# EAGLE design 23b_clock_noleds (EAGLE 5.11)

## Sheet 1 of 2
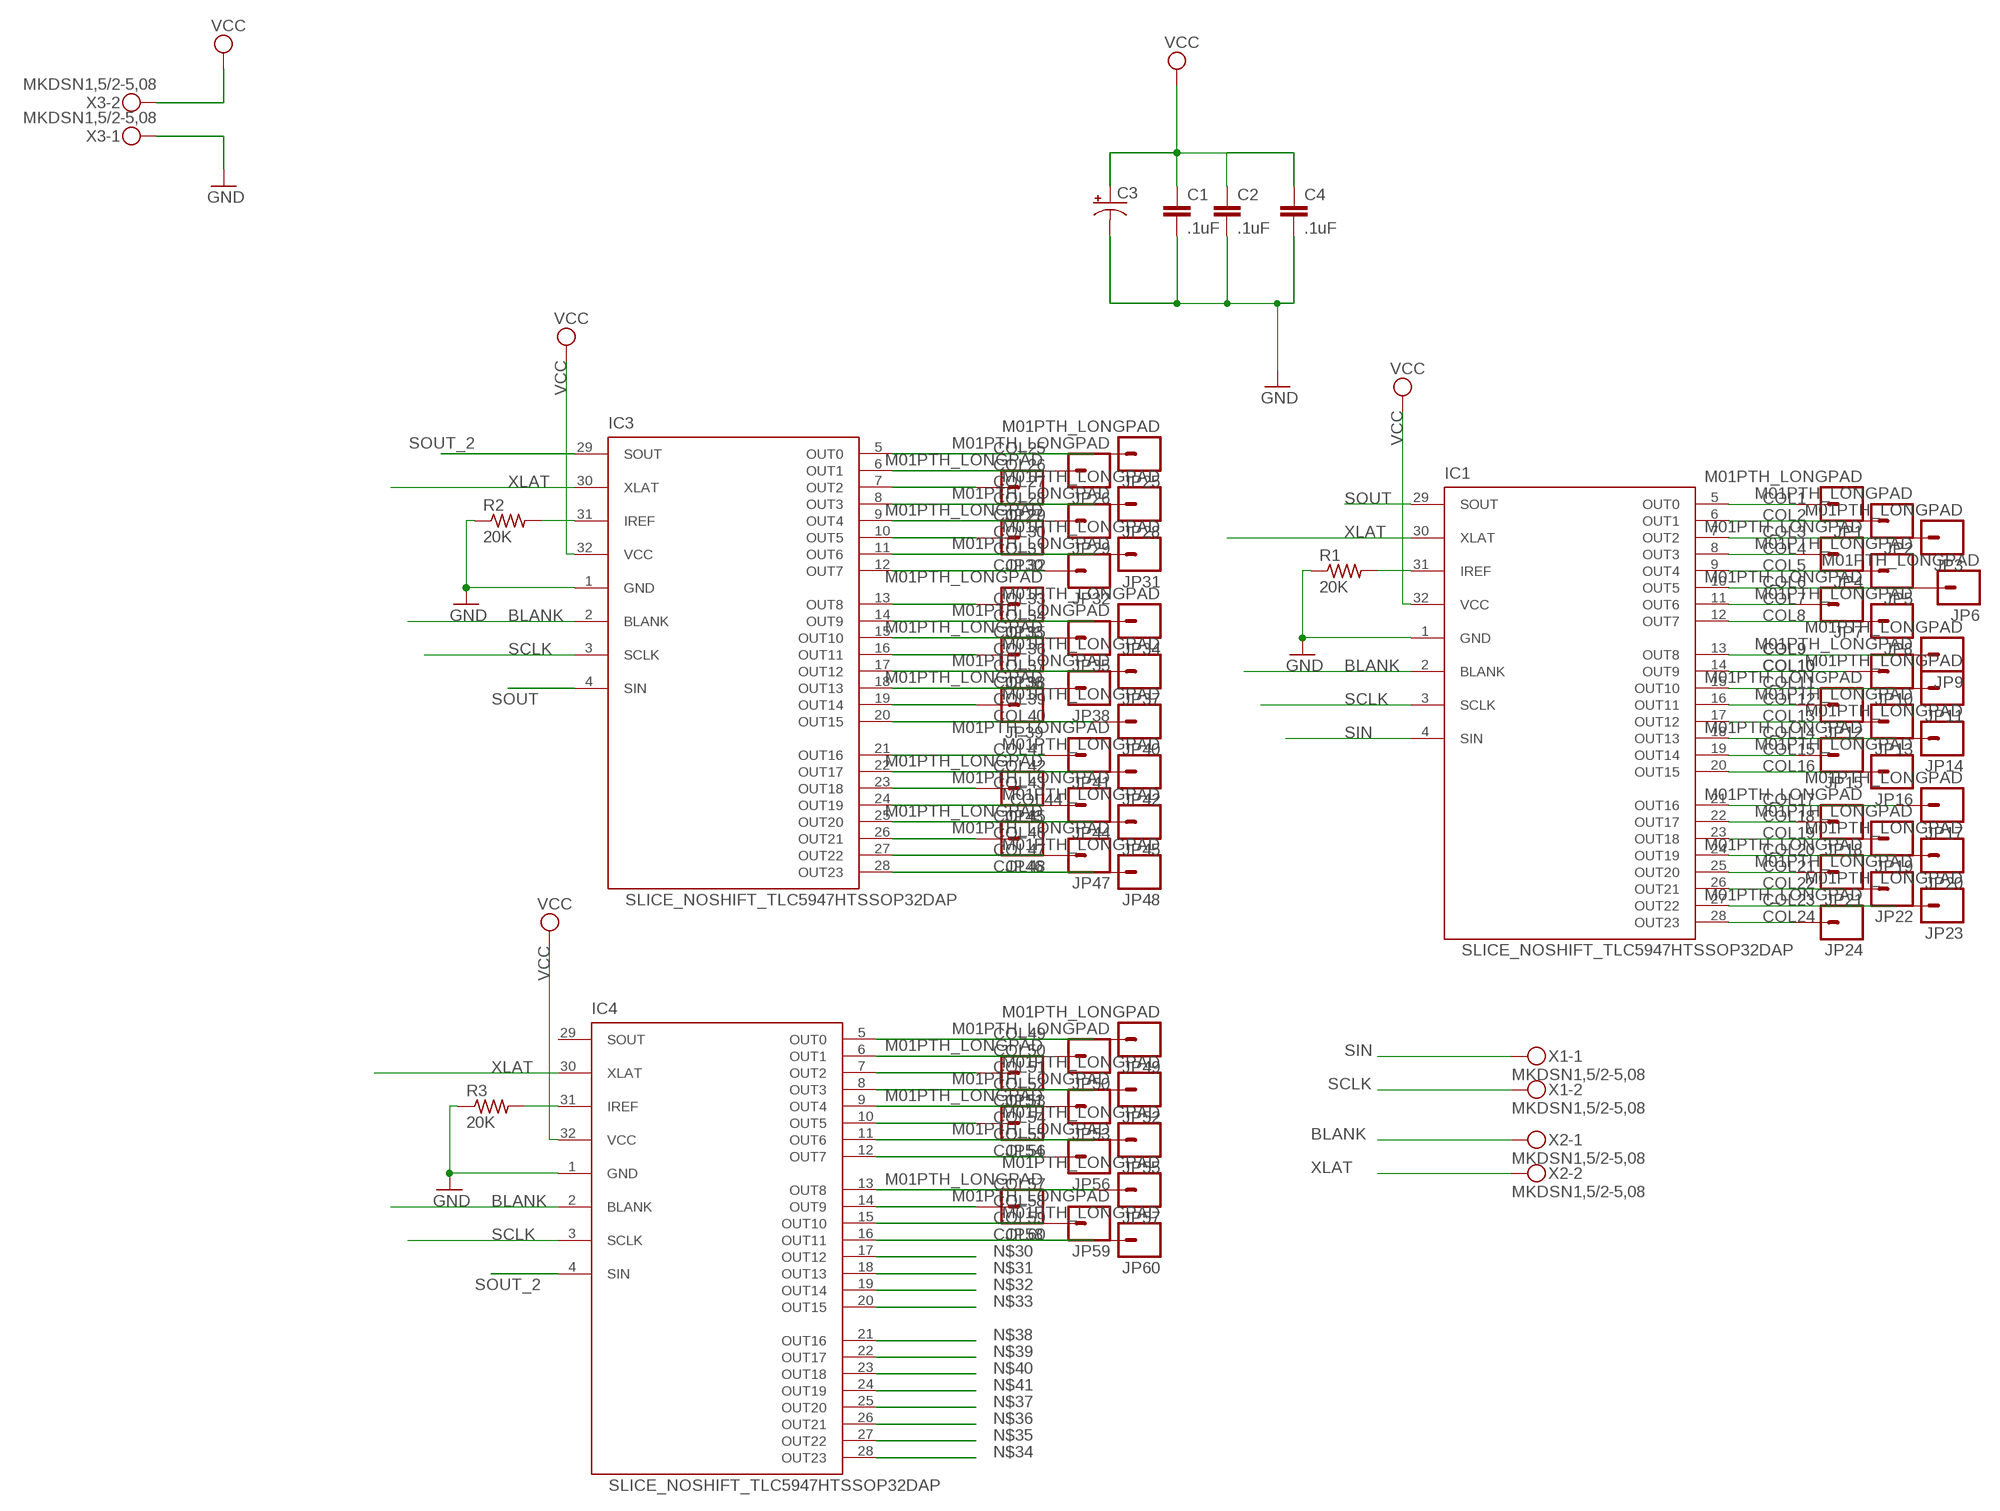
[diagram p0: schematic, sheet 1]

### Parts
C1  .1uF  CAP0805  [0805]
C2  .1uF  CAP0805  [0805]
C3  CAP_POL7343  [EIA7343]
C4  .1uF  CAP0805  [0805]
IC1  SLICE_NOSHIFT_TLC5947HTSSOP32DAP  [HTSSOP32DAP]
IC3  SLICE_NOSHIFT_TLC5947HTSSOP32DAP  [HTSSOP32DAP]
IC4  SLICE_NOSHIFT_TLC5947HTSSOP32DAP  [HTSSOP32DAP]
JP1  M01PTH_LONGPAD  [1X01_LONGPAD]
JP2  M01PTH_LONGPAD  [1X01_LONGPAD]
JP3  M01PTH_LONGPAD  [1X01_LONGPAD]
JP4  M01PTH_LONGPAD  [1X01_LONGPAD]
JP5  M01PTH_LONGPAD  [1X01_LONGPAD]
JP6  M01PTH_LONGPAD  [1X01_LONGPAD]
JP7  M01PTH_LONGPAD  [1X01_LONGPAD]
JP8  M01PTH_LONGPAD  [1X01_LONGPAD]
JP9  M01PTH_LONGPAD  [1X01_LONGPAD]
JP10  M01PTH_LONGPAD  [1X01_LONGPAD]
JP11  M01PTH_LONGPAD  [1X01_LONGPAD]
JP12  M01PTH_LONGPAD  [1X01_LONGPAD]
JP13  M01PTH_LONGPAD  [1X01_LONGPAD]
JP14  M01PTH_LONGPAD  [1X01_LONGPAD]
JP15  M01PTH_LONGPAD  [1X01_LONGPAD]
JP16  M01PTH_LONGPAD  [1X01_LONGPAD]
JP17  M01PTH_LONGPAD  [1X01_LONGPAD]
JP18  M01PTH_LONGPAD  [1X01_LONGPAD]
JP19  M01PTH_LONGPAD  [1X01_LONGPAD]
JP20  M01PTH_LONGPAD  [1X01_LONGPAD]
JP21  M01PTH_LONGPAD  [1X01_LONGPAD]
JP22  M01PTH_LONGPAD  [1X01_LONGPAD]
JP23  M01PTH_LONGPAD  [1X01_LONGPAD]
JP24  M01PTH_LONGPAD  [1X01_LONGPAD]
JP25  M01PTH_LONGPAD  [1X01_LONGPAD]
JP26  M01PTH_LONGPAD  [1X01_LONGPAD]
JP27  M01PTH_LONGPAD  [1X01_LONGPAD]
JP28  M01PTH_LONGPAD  [1X01_LONGPAD]
JP29  M01PTH_LONGPAD  [1X01_LONGPAD]
JP30  M01PTH_LONGPAD  [1X01_LONGPAD]
JP31  M01PTH_LONGPAD  [1X01_LONGPAD]
JP32  M01PTH_LONGPAD  [1X01_LONGPAD]
JP33  M01PTH_LONGPAD  [1X01_LONGPAD]
JP34  M01PTH_LONGPAD  [1X01_LONGPAD]
JP35  M01PTH_LONGPAD  [1X01_LONGPAD]
JP36  M01PTH_LONGPAD  [1X01_LONGPAD]
JP37  M01PTH_LONGPAD  [1X01_LONGPAD]
JP38  M01PTH_LONGPAD  [1X01_LONGPAD]
JP39  M01PTH_LONGPAD  [1X01_LONGPAD]
JP40  M01PTH_LONGPAD  [1X01_LONGPAD]
JP41  M01PTH_LONGPAD  [1X01_LONGPAD]
JP42  M01PTH_LONGPAD  [1X01_LONGPAD]
JP43  M01PTH_LONGPAD  [1X01_LONGPAD]
JP44  M01PTH_LONGPAD  [1X01_LONGPAD]
JP45  M01PTH_LONGPAD  [1X01_LONGPAD]
JP46  M01PTH_LONGPAD  [1X01_LONGPAD]
JP47  M01PTH_LONGPAD  [1X01_LONGPAD]
JP48  M01PTH_LONGPAD  [1X01_LONGPAD]
JP49  M01PTH_LONGPAD  [1X01_LONGPAD]
JP50  M01PTH_LONGPAD  [1X01_LONGPAD]
JP51  M01PTH_LONGPAD  [1X01_LONGPAD]
JP52  M01PTH_LONGPAD  [1X01_LONGPAD]
JP53  M01PTH_LONGPAD  [1X01_LONGPAD]
JP54  M01PTH_LONGPAD  [1X01_LONGPAD]
JP55  M01PTH_LONGPAD  [1X01_LONGPAD]
JP56  M01PTH_LONGPAD  [1X01_LONGPAD]
JP57  M01PTH_LONGPAD  [1X01_LONGPAD]
JP58  M01PTH_LONGPAD  [1X01_LONGPAD]
JP59  M01PTH_LONGPAD  [1X01_LONGPAD]
JP60  M01PTH_LONGPAD  [1X01_LONGPAD]
R1  20K  R-US_R0805  [R0805]
R2  20K  R-US_R0805  [R0805]
R3  20K  R-US_R0805  [R0805]
X1  MKDSN1,5/2-5,08  [MKDSN1,5/2-5,08]
X2  MKDSN1,5/2-5,08  [MKDSN1,5/2-5,08]
X3  MKDSN1,5/2-5,08  [MKDSN1,5/2-5,08]

### Nets
BLANK: IC1.2(BLANK) IC3.2(BLANK) IC4.2(BLANK) X2.1
COL1: IC1.5(OUT0) JP1.1
COL2: IC1.6(OUT1) JP2.1
COL3: IC1.7(OUT2) JP3.1
COL4: IC1.8(OUT3) JP4.1
COL5: IC1.9(OUT4) JP5.1
COL6: IC1.10(OUT5) JP6.1
COL7: IC1.11(OUT6) JP7.1
COL8: IC1.12(OUT7) JP8.1
COL9: IC1.13(OUT8) JP9.1
COL10: IC1.14(OUT9) JP10.1
COL11: IC1.15(OUT10) JP11.1
COL12: IC1.16(OUT11) JP12.1
COL13: IC1.17(OUT12) JP13.1
COL14: IC1.18(OUT13) JP14.1
COL15: IC1.19(OUT14) JP15.1
COL16: IC1.20(OUT15) JP16.1
COL17: IC1.21(OUT16) JP17.1
COL18: IC1.22(OUT17) JP18.1
COL19: IC1.23(OUT18) JP19.1
COL20: IC1.24(OUT19) JP20.1
COL21: IC1.25(OUT20) JP21.1
COL22: IC1.26(OUT21) JP22.1
COL23: IC1.27(OUT22) JP23.1
COL24: IC1.28(OUT23) JP24.1
COL25: IC3.5(OUT0) JP25.1
COL26: IC3.6(OUT1) JP26.1
COL27: IC3.7(OUT2) JP27.1
COL28: IC3.8(OUT3) JP28.1
COL29: IC3.9(OUT4) JP29.1
COL30: IC3.10(OUT5) JP30.1
COL31: IC3.11(OUT6) JP31.1
COL32: IC3.12(OUT7) JP32.1
COL33: IC3.13(OUT8) JP33.1
COL34: IC3.14(OUT9) JP34.1
COL35: IC3.15(OUT10) JP35.1
COL36: IC3.16(OUT11) JP36.1
COL37: IC3.17(OUT12) JP37.1
COL38: IC3.18(OUT13) JP38.1
COL39: IC3.19(OUT14) JP39.1
COL40: IC3.20(OUT15) JP40.1
COL41: IC3.21(OUT16) JP41.1
COL42: IC3.22(OUT17) JP42.1
COL43: IC3.23(OUT18) JP43.1
COL44: IC3.24(OUT19) JP44.1
COL45: IC3.25(OUT20) JP45.1
COL46: IC3.26(OUT21) JP46.1
COL47: IC3.27(OUT22) JP47.1
COL48: IC3.28(OUT23) JP48.1
COL49: IC4.5(OUT0) JP49.1
COL50: IC4.6(OUT1) JP50.1
COL51: IC4.7(OUT2) JP51.1
COL52: IC4.8(OUT3) JP52.1
COL53: IC4.9(OUT4) JP53.1
COL54: IC4.10(OUT5) JP54.1
COL55: IC4.11(OUT6) JP55.1
COL56: IC4.12(OUT7) JP56.1
COL57: IC4.13(OUT8) JP57.1
COL58: IC4.14(OUT9) JP58.1
COL59: IC4.15(OUT10) JP59.1
COL60: IC4.16(OUT11) JP60.1
GND: C1.2 C2.2 C3.C(-) C4.2 IC1.1(GND) IC3.1(GND) IC4.1(GND) R1.1 R2.1 R3.1 X3.1
N$1: IC3.31(IREF) R2.2
N$13: IC1.31(IREF) R1.2
N$30: IC4.17(OUT12)
N$31: IC4.18(OUT13)
N$32: IC4.19(OUT14)
N$33: IC4.20(OUT15)
N$34: IC4.28(OUT23)
N$35: IC4.27(OUT22)
N$36: IC4.26(OUT21)
N$37: IC4.25(OUT20)
N$38: IC4.21(OUT16)
N$39: IC4.22(OUT17)
N$40: IC4.23(OUT18)
N$41: IC4.24(OUT19)
N$64: IC4.31(IREF) R3.2
SCLK: IC1.3(SCLK) IC3.3(SCLK) IC4.3(SCLK) X1.2
SIN: IC1.4(SIN) X1.1
SOUT: IC1.29(SOUT) IC3.4(SIN)
SOUT_2: IC3.29(SOUT) IC4.4(SIN)
VCC: C1.1 C2.1 C3.A(+) C4.1 IC1.32(VCC) IC3.32(VCC) IC4.32(VCC) X3.2
XLAT: IC1.30(XLAT) IC3.30(XLAT) IC4.30(XLAT) X2.2
Unconnected: IC4.29(SOUT)

## Sheet 2 of 2

## Library data of the parts
C1 C2 C4 = slice_noshift:CAP: Capacitor Standard 0603 ceramic capacitor, and 0.1" leaded capacitor.
C3 = SparkFun:CAP_POL: Capacitor Polarized These are standard SMD and PTH capacitors. Normally 10uF, 47uF, and 100uF in electrolytic and tantalum varieties. Always verify the external diameter of the through hole cap, it varies with capacity, voltage, and manufacturer. The EIA devices should be standard.
IC1 IC3 IC4 = 23b_clock_noleds:SLICE_NOSHIFT_TLC5947
JP1-JP60 = SparkFun:M01: Header 1 Standard 1-pin 0.1" header. Use with straight break away headers (SKU : PRT-00116), right angle break away headers (PRT-00553), swiss pins (PRT-00743), machine pins (PRT-00117), and female headers (PRT-00115).
R1-R3 = rcl:R-US_: RESISTOR, American symbol
X1-X3 = con-phoenix-508:MKDSN1,5/2-5,08: MKDSN 1,5/ 2-5,08 Printklemme Nennstrom: 13,5 A Nennspannung: 250 V Rastermaß: 5,08 mm Polzahl: 2 Anschlussart: Schraubanschluss Montage: Löten Anschlussrichtung Leiter/Platine: 0 ° Artikelnummer: 1729128 Source: http://eshop.phoenixcontact.com .. 1729128.pdf; MPN: MKDSN 1,5/2-5.08; OC_FARNELL: 1792903; OC_NEWARK: 30M2397

## Board
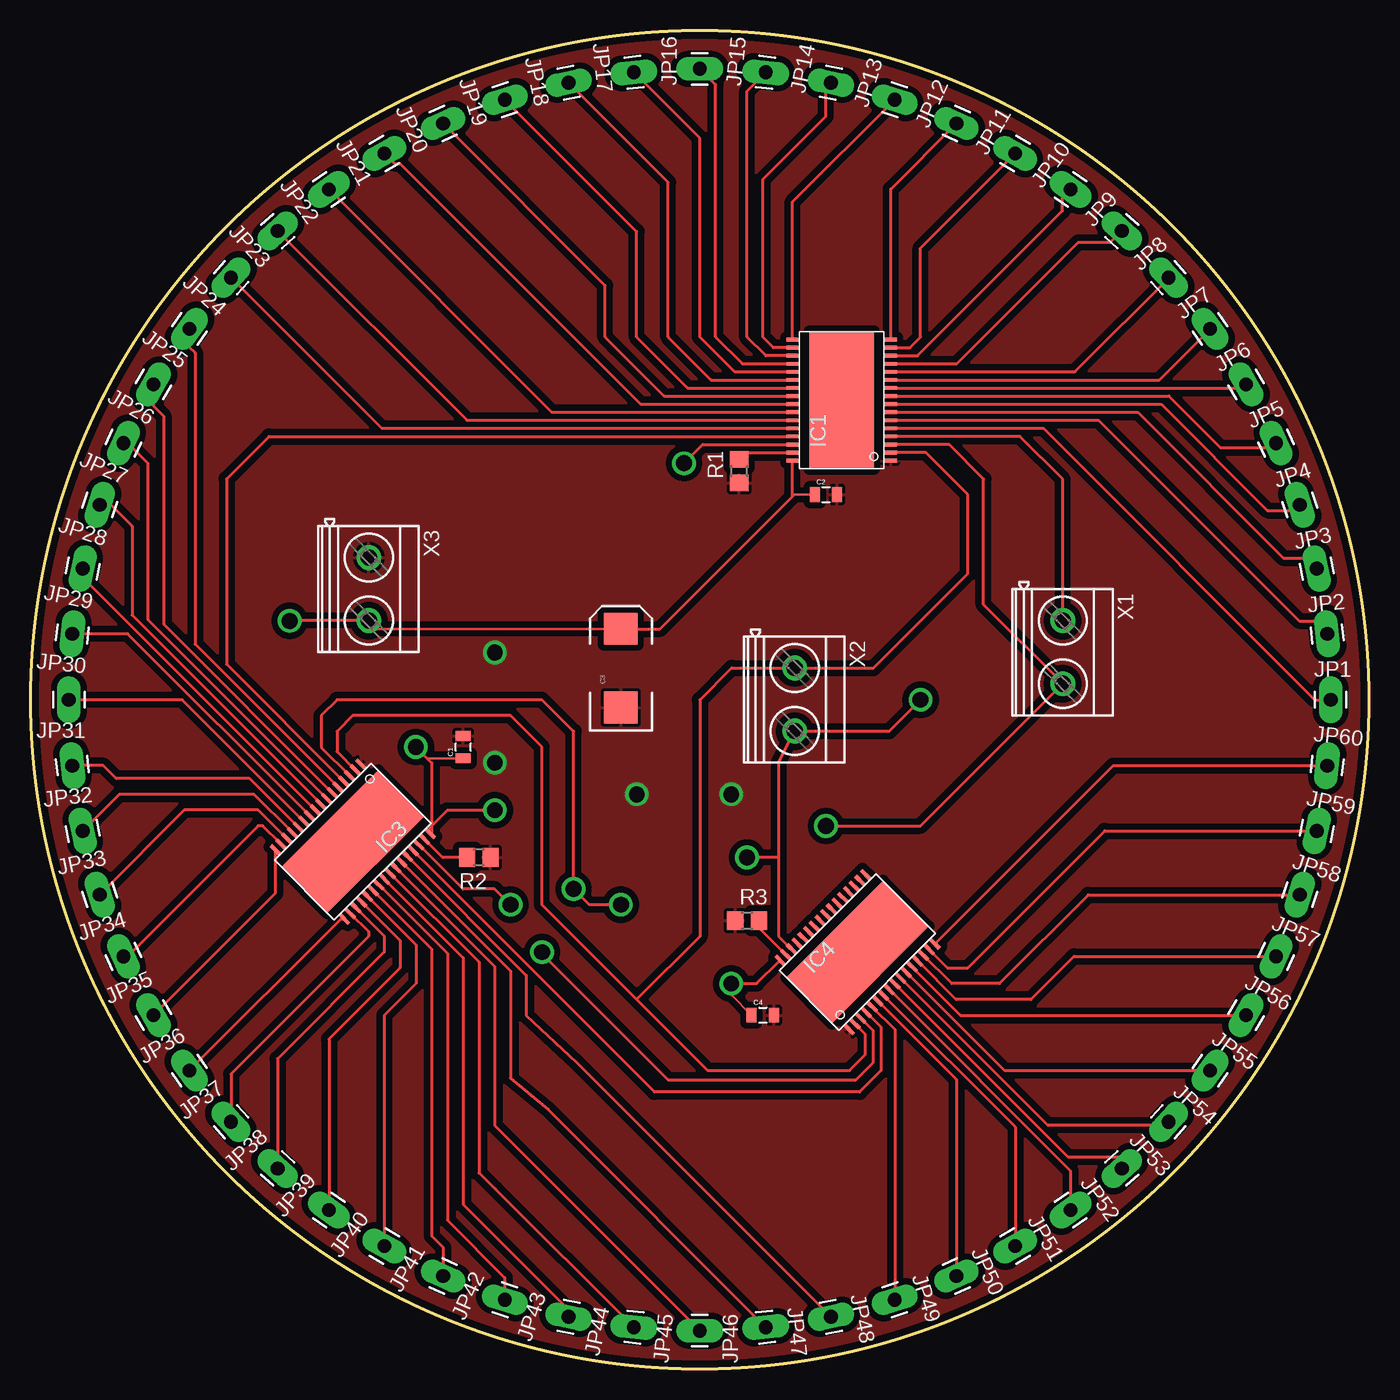
[diagram p1: board, top side]
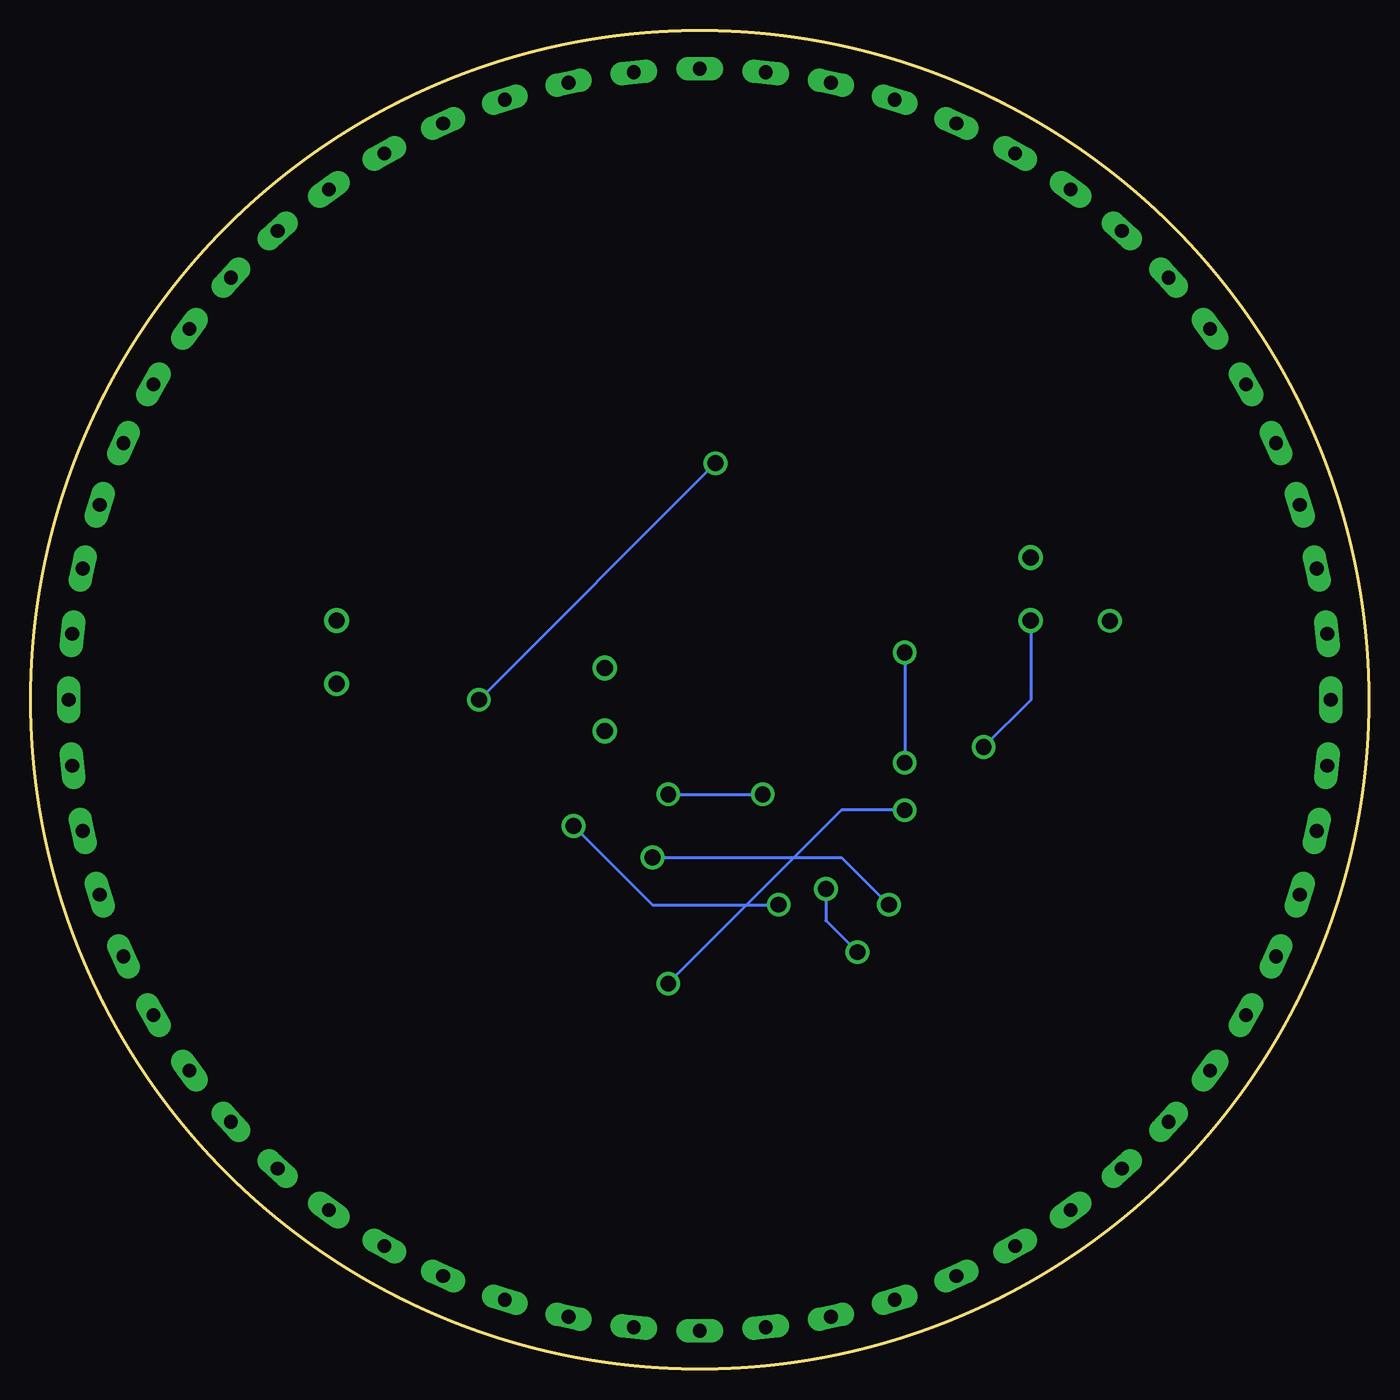
[diagram p2: board, bottom side, seen from below]

Size 107.7 x 107.7 mm. Coordinates in mm from the lower left corner, seen from the top.
Outline: circle at 53.85,53.85 radius 53.85
Copper layers (1*16): Top 0.0356mm / dielectric 1.5011mm / Bottom 0.0356mm
Design rules "SparkFun-mod": minimum track width 8mil, minimum drill 20mil, track to track 12mil, track to pad 12mil, pad to pad 8mil, via to via 8mil, smd to smd 8mil, copper to edge 12mil, drill to drill 8mil, minimum pad ring 12mil, minimum via ring 10mil, stop-mask expansion 4mil, vias tented up to drill 25mil, thermal gap 10mil

### Footprints (pad centres in the part's own frame; a part is rotated, then mirrored left to right if it is on the bottom)
0805 = smd 0.8 x 1.2: 1 -0.9,0; 2 0.9,0
EIA7343 = smd 2.55 x 2.7: A 3.17,0; C -3.17,0
HTSSOP32DAP = smd 0.3 x 1: 1 -4.875,-3.95; 2 -4.225,-3.95; 3 -3.575,-3.95; 4 -2.925,-3.95; 5 -2.275,-3.95; 6 -1.625,-3.95; 7 -0.975,-3.95; 8 -0.325,-3.95; 9 0.325,-3.95; 10 0.975,-3.95; 11 1.625,-3.95; 12 2.275,-3.95; 13 2.925,-3.95; 14 3.575,-3.95; 15 4.225,-3.95; 16 4.875,-3.95; 17 4.875,3.95; 18 4.225,3.95; 19 3.575,3.95; 20 2.925,3.95; 21 2.275,3.95; 22 1.625,3.95; 23 0.975,3.95; 24 0.325,3.95; 25 -0.325,3.95; 26 -0.975,3.95; 27 -1.625,3.95; 28 -2.275,3.95; 29 -2.925,3.95; 30 -3.575,3.95; 31 -4.225,3.95; 32 -4.875,3.95 | smd 11 x 5.2: EXP 0,0
1X01_LONGPAD = drill 1.118 pad 1.88 long: 1 0,0
R0805 = smd 1.3 x 1.5: 1 -0.95,0; 2 0.95,0
MKDSN1,5/2-5,08 = drill 1.3 pad 2 round: 1 -2.561,0.025; 2 2.519,0.025

### Placement (x,y rotation side)
C1  34.8,50.04 90 top
C2  64.01,70.36 0 top
C3  47.5,56.39 90 top
C4  58.93,28.45 0 top
IC1  65.28,77.98 90 top
IC3  25.91,42.42 225 top
IC4  66.55,33.53 45 top
JP1  104.65,53.85 0 top
JP2  104.37,59.16 6 top
JP3  103.54,64.41 12 top
JP4  102.16,69.55 18 top
JP5  100.26,74.51 24 top
JP6  97.84,79.25 30 top
JP7  94.95,83.71 36 top
JP8  91.6,87.84 42 top
JP9  87.84,91.6 48 top
JP10  83.71,94.95 54 top
JP11  79.25,97.84 60 top
JP12  74.51,100.26 66 top
JP13  69.55,102.16 72 top
JP14  64.41,103.54 78 top
JP15  59.16,104.37 84 top
JP16  53.85,104.65 90 top
JP17  48.54,104.37 96 top
JP18  43.29,103.54 102 top
JP19  38.15,102.16 108 top
JP20  33.19,100.26 114 top
JP21  28.45,97.84 120 top
JP22  23.99,94.95 126 top
JP23  19.86,91.6 132 top
JP24  16.1,87.84 138 top
JP25  12.75,83.71 144 top
JP26  9.85,79.25 150 top
JP27  7.44,74.51 156 top
JP28  5.53,69.55 162 top
JP29  4.16,64.41 168 top
JP30  3.33,59.16 174 top
JP31  3.05,53.85 180 top
JP32  3.33,48.54 186 top
JP33  4.16,43.29 192 top
JP34  5.53,38.15 198 top
JP35  7.44,33.19 204 top
JP36  9.85,28.45 210 top
JP37  12.75,23.99 216 top
JP38  16.1,19.86 222 top
JP39  19.86,16.1 228 top
JP40  23.99,12.75 234 top
JP41  28.45,9.85 240 top
JP42  33.19,7.44 246 top
JP43  38.15,5.53 252 top
JP44  43.29,4.16 258 top
JP45  48.54,3.33 264 top
JP46  53.85,3.05 270 top
JP47  59.16,3.33 276 top
JP48  64.41,4.16 282 top
JP49  69.55,5.53 288 top
JP50  74.51,7.44 294 top
JP51  79.25,9.85 300 top
JP52  83.71,12.75 306 top
JP53  87.84,16.1 312 top
JP54  91.6,19.86 318 top
JP55  94.95,23.99 324 top
JP56  97.84,28.45 330 top
JP57  100.26,33.19 336 top
JP58  102.16,38.15 342 top
JP59  103.54,43.29 348 top
JP60  104.37,48.54 354 top
R1  57.02,72.26 90 top
R2  36.07,41.15 180 top
R3  57.66,36.07 0 top
X1  83.06,57.66 270 top
X2  61.47,53.85 270 top
X3  27.18,62.74 270 top
X4  MKDSN1,5/2-5,08  [MKDSN1,5/2-5,08]  -12.19,71.63 0 top  (outside the outline)
X5  MKDSN1,5/2-5,08  [MKDSN1,5/2-5,08]  -13.46,48.77 0 top  (outside the outline)

### Tracks (layer width: path | path; a pad name or v marks a point on that pad's centre or on a via)
BLANK
  Top 0.254: IC4.2 67.18,26.92 67.18,25.27 65.91,24 54.48,24 48.77,29.72 | 48.77,29.72 41.15,37.34 41.15,50.04 38.61,52.58 25.91,52.58 24.64,51.31 24.64,49.66 IC3.2 | IC1.2 72.04,73.75 75.44,70.36 75.44,64.01 67.82,56.39 61.51,56.39 X2.1 56.41,56.41 53.85,53.85 53.85,34.8 48.77,29.72
COL1
  Top 0.254: IC1.5 81.52,75.7 103.38,53.85 JP1.1
COL2
  Top 0.254: IC1.6 85.95,76.35 102.11,60.2 103.33,60.2 JP2.1
COL3
  Top 0.254: IC1.7 89.11,77 100.84,65.28 102.67,65.28 JP3.1
COL4
  Top 0.254: IC1.8 91,77.65 99.57,69.09 101.7,69.09 JP4.1
COL5
  Top 0.254: IC1.9 91.62,78.3 95.76,74.17 99.91,74.17 JP5.1
COL6
  Top 0.254: IC1.10 97.55,78.95 JP6.1
COL7
  Top 0.254: IC1.11 90.84,79.6 JP7.1
COL8
  Top 0.254: IC1.12 84.06,80.25 91.95,88.14 91.9,88.14 JP8.1
COL9
  Top 0.254: IC1.13 74.55,80.9 84.33,90.68 86.92,90.68 JP9.1
COL10
  Top 0.254: IC1.14 71.39,81.55 83.06,93.22 83.06,94.3 JP10.1
COL11
  Top 0.254: IC1.15 70.77,82.2 71.63,83.06 71.63,90.22 JP11.1
COL12
  Top 0.254: IC1.16 69.23,94.97 JP12.1
COL13
  Top 0.254: IC1.17 61.33,93.94 JP13.1
COL14
  Top 0.254: IC1.18 59.78,82.2 58.93,83.06 58.93,95.76 64.01,100.84 64.01,103.14 JP14.1
COL15
  Top 0.254: IC1.19 59.16,81.55 57.66,83.06 57.66,102.87 JP15.1
COL16
  Top 0.254: IC1.20 57.27,80.9 55.12,83.06 55.12,103.38 JP16.1
COL17
  Top 0.254: IC1.21 56.65,80.25 53.85,83.06 53.85,99.06 JP17.1
COL18
  Top 0.254: IC1.22 54.76,79.6 51.31,83.06 51.31,95.52 JP18.1
COL19
  Top 0.254: IC1.23 52.87,78.95 48.77,83.06 48.77,91.54 JP19.1
COL20
  Top 0.254: IC1.24 50.98,78.3 46.23,83.06 46.23,87.21 JP20.1
COL21
  Top 0.254: IC1.25 49.09,77.65 29.72,97.03 29.26,97.03 JP21.1
COL22
  Top 0.254: IC1.26 41.93,77 JP22.1
COL23
  Top 0.254: IC1.27 35.1,76.35 JP23.1
COL24
  Top 0.254: IC1.28 28.23,75.7 JP24.1
COL25
  Top 0.254: IC3.5 13.21,58.34 13.21,81.79 12.75,82.25 JP25.1
COL26
  Top 0.254: IC3.6 10.67,59.96 10.67,76.71 9.85,77.52 JP26.1
COL27
  Top 0.254: IC3.7 9.4,60.31 9.4,72.9 7.78,74.51 JP27.1
COL28
  Top 0.254: IC3.8 8.13,60.66 8.13,67.82 6.4,69.55 JP28.1
COL29
  Top 0.254: IC3.9 4.16,63.71 JP29.1
COL30
  Top 0.254: IC3.10 7.79,59.16 JP30.1
COL31
  Top 0.254: IC3.11 12.18,53.85 JP31.1
COL32
  Top 0.254: IC3.12 17.61,47.5 6.86,47.5 5.82,48.54 JP32.1
COL33
  Top 0.254: IC3.13 17.96,46.23 7.1,46.23 JP33.1
COL34
  Top 0.254: IC3.14 20.56,42.68 18.29,44.96 12.34,44.96 JP34.1
COL35
  Top 0.254: IC3.15 18.66,43.69 18.29,43.69 7.78,33.19 JP35.1
COL36
  Top 0.254: JP36.1 19.67,38.26 IC3.16
COL37
  Top 0.254: JP37.1 24.94,36.18 IC3.17
COL38
  Top 0.254: IC3.18 27.18,35.17 27.18,34.8 16.1,23.72 JP38.1
COL39
  Top 0.254: IC3.19 28.45,34.82 28.45,33.53 19.85,24.93 JP39.1
COL40
  Top 0.254: IC3.20 29.72,34.47 29.72,32.26 23.99,26.53 JP40.1
COL41
  Top 0.254: IC3.21 30.99,34.12 30.99,30.99 28.45,28.45 JP41.1
COL42
  Top 0.254: IC3.22 32.26,33.77 32.26,10.67 33.19,9.74 JP42.1
COL43
  Top 0.254: IC3.23 33.53,33.42 33.53,11.94 38.15,7.31 JP43.1
COL44
  Top 0.254: IC3.24 34.8,33.07 34.8,13.21 43.29,4.72 JP44.1
COL45
  Top 0.254: IC3.25 36.07,32.72 36.07,15.75 37.39,14.48 JP45.1
COL46
  Top 0.254: IC3.26 37.34,32.37 37.34,19.56 JP46.1
COL47
  Top 0.254: IC3.27 38.61,32.02 38.61,23.37 41.66,20.83 JP47.1
COL48
  Top 0.254: IC3.28 39.88,31.66 39.88,28.45 43.93,24.64 JP48.1
COL49
  Top 0.254: IC4.5 69.55,27.31 JP49.1
COL50
  Top 0.254: IC4.6 74.51,23.27 JP50.1
COL51
  Top 0.254: IC4.7 79.25,19.45 JP51.1
COL52
  Top 0.254: IC4.8 83.71,15.91 JP52.1
COL53
  Top 0.254: IC4.9 83.52,17.02 88.14,17.02 87.84,16.72 JP53.1
COL54
  Top 0.254: IC4.10 81.9,19.56 91.95,19.56 91.65,19.85 JP54.1
COL55
  Top 0.254: IC4.11 78.39,23.99 JP55.1
COL56
  Top 0.254: IC4.12 74.84,28.45 JP56.1
COL57
  Top 0.254: IC4.13 74.5,29.72 80.52,29.72 83.98,33.19 JP57.1
COL58
  Top 0.254: IC4.14 74.14,30.99 77.98,30.99 85.14,38.15 JP58.1
COL59
  Top 0.254: IC4.15 73.79,32.26 75.44,32.26 86.47,43.29 JP59.1
COL60
  Top 0.254: IC4.16 87.14,48.54 JP60.1
GND  (via drill 1.27)
  Bottom 0.254: v37.34,57.66 v37.34,48.77 | v56.39,46.23 v48.77,46.23
  pour Top (isolate 0.508): 111,108.46 -5.84,109.73 -7.11,-3.3 111,-3.3
N$1
  Top 0.254: IC3.31 33.15,41.15 R2.2
N$13
  Top 0.254: IC1.31 57.56,73.75 R1.2
N$64
  Top 0.254: IC4.31 58.61,35.49 R3.2
SCLK  (via drill 1.27)
  Top 0.254: IC3.3 23.37,50.01 23.37,52.58 24.64,53.85 41.15,53.85 43.69,51.31 v43.69,38.61 44.96,37.34 v47.5,37.34 | IC1.3 73.93,74.4 76.71,71.63 76.71,61.51 X1.2 71.63,43.69 v64.01,43.69 | IC4.3 67.82,27.2 67.82,24.64 66.42,23.24 51.31,23.24 41.15,33.4 v41.15,33.53
  Bottom 0.254: v41.15,33.53 43.69,36.07 v43.69,38.61 | v47.5,37.34 57.66,37.34 v64.01,43.69
SIN
  Top 0.254: IC1.4 79.63,75.05 83.08,71.6 X1.1
SOUT
  Top 0.254: IC1.29 19.17,75.05 15.75,71.63 15.75,56.71 IC3.4
SOUT_2
  Top 0.254: IC3.29 50.2,22.26 66.71,22.26 68.45,24 68.45,27.49 IC4.4
VCC  (via drill 1.27)
  Top 0.203: C1.1 31.89,49.14 v30.99,50.04 | C3.A 27.86,59.56 X3.2 | C2.1 61.47,70.36 61.33,70.22 | C4.1 56.39,30.09 v56.39,30.99
  Top 0.254: IC4.32 58.42,30.99 v56.39,30.99 | 26.81,59.83 X3.2 20.85,60.22 v20.83,60.2 | 47.23,59.83 C3.A 50.67,59.56 61.33,70.22 IC1.32 | v30.99,50.04 32.26,48.77 32.26,43.18 IC3.32 32.15,43.58 33.53,44.96 v37.34,44.96
  Bottom 0.254: v30.99,50.04 27.2,53.82 X3.2 | v56.39,30.99 42.42,44.96 v37.34,44.96
XLAT  (via drill 1.27)
  Top 0.254: IC1.30 54.08,74.4 v52.58,72.9 | IC4.30 61.2,33.79 60.2,34.8 60.2,41.15 | IC3.30 34.77,38.61 37.34,38.61 v38.61,37.34 | 60.2,41.15 60.2,48.76 X2.2 69.11,51.33 v71.63,53.85 | 60.2,41.15 v57.66,41.15
  Bottom 0.254: v38.61,37.34 42.42,41.15 v57.66,41.15 | v71.63,53.85 v52.58,72.9